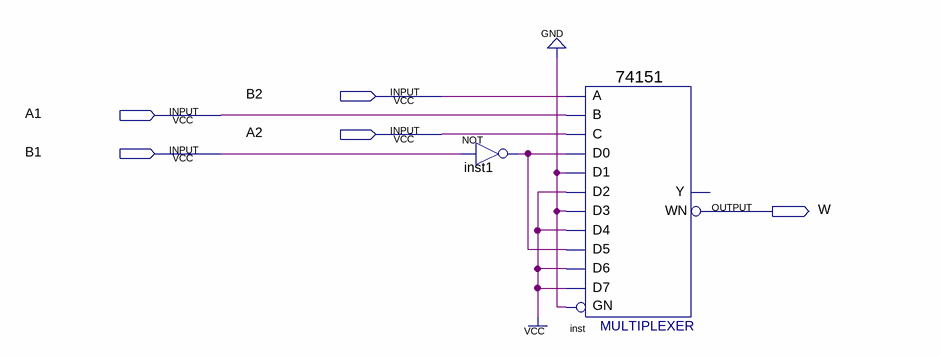
[diagram p0: schematic sheet]
// Quartus schematic Lab12.bdf as structural Verilog: 2 symbols, 5 pins
module Lab12 (
  input  B2,
  input  A1,
  input  A2,
  input  B1,
  output W
);

  wire inst1_out;

  not inst1 (inst1_out, B1);
  \74151  inst (
    .GN(1'b0), .C(A2), .B(A1), .A(B2), .D5(inst1_out), .D0(inst1_out), .D1(1'b0), .D4(1'b1), .D3(1'b0),
    .D2(1'b1), .D6(1'b1), .D7(1'b1), .WN(W));  // open: Y
endmodule
